# Altium schematic sheet 12_USB3.1 Type-A x2 (A).SchDoc: C200
size 439 x 311 mm; Page Create Date: March  8, 1995; Page Number: 12; Page Size: Custom; Comment: radxa_1010; Page Count: 21; RevCode: V1.11; Doc: 12_USB3.1 Type-A x2 (A); DsnPath: D:\WMS\C200\CC122\对外\C200 V1.11.DSN; SchematicName: c200; PageName: 12_USB3.1 Type-A x2 (A); PageSize: Custom; TopSchematic: True
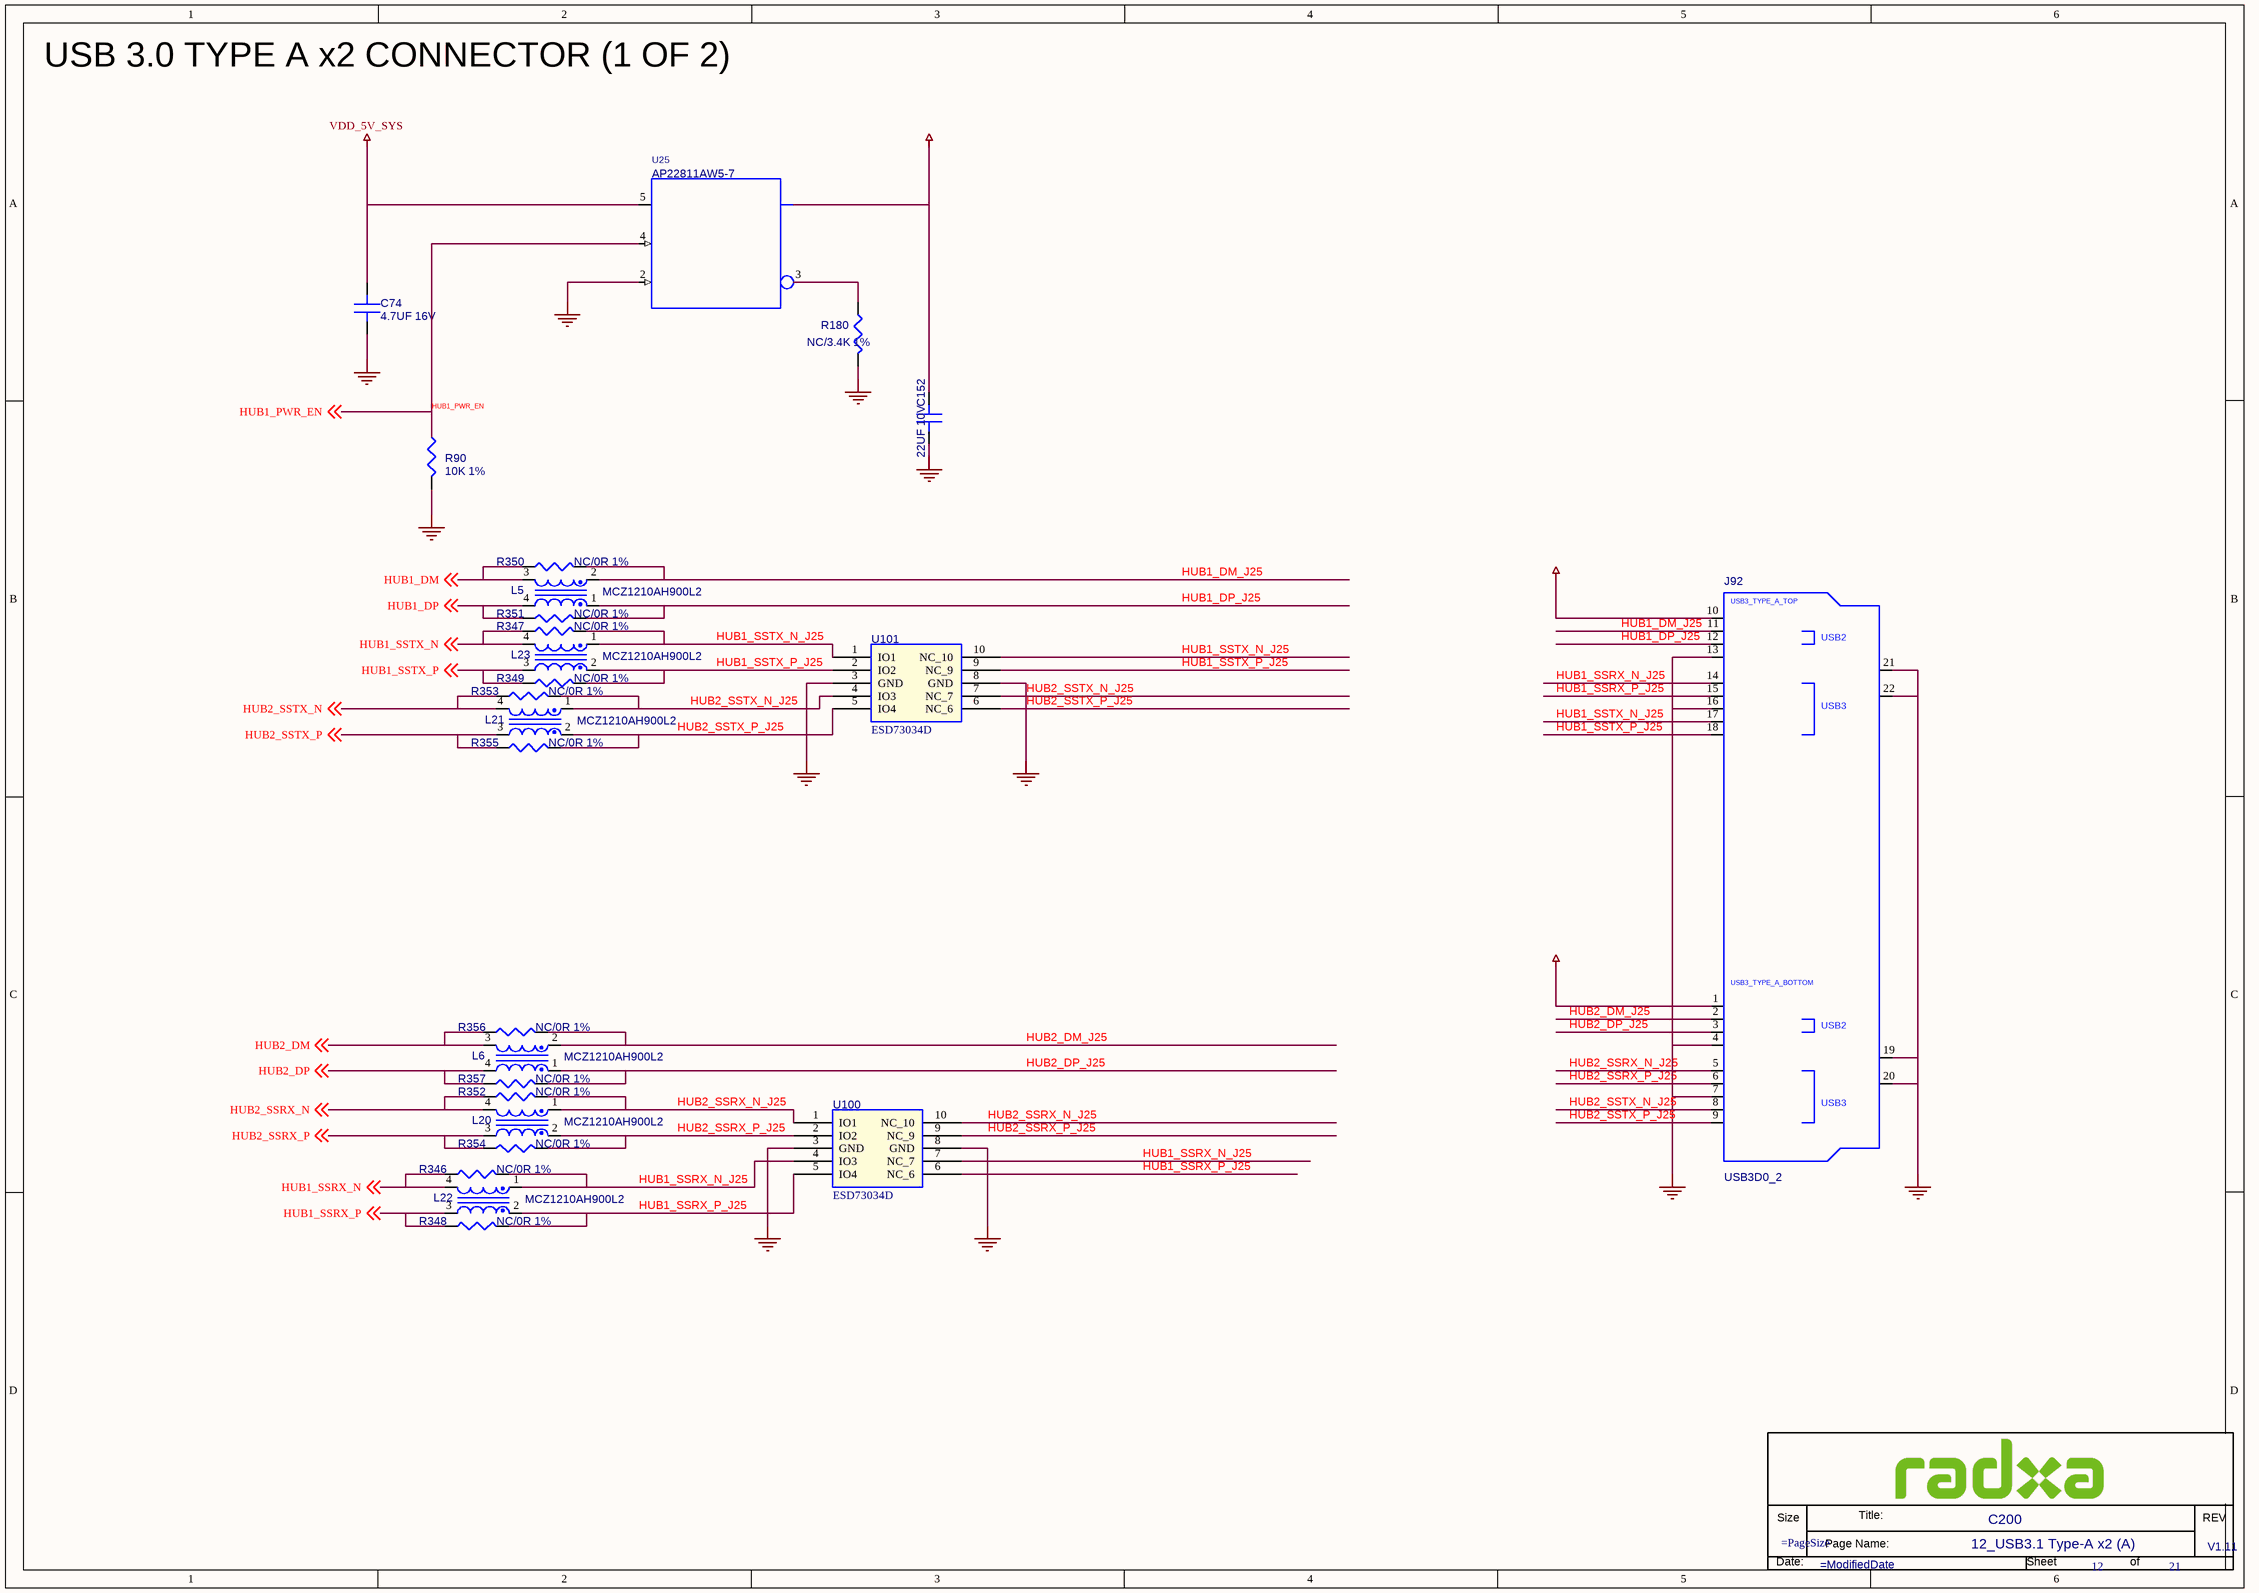
[diagram p0: 12_USB3.1 Type-A x2 (A).SchDoc]

## Parts
*  Doc: 12_USB3.1 Type-A x2 (A)  RevCode: V1.11  Title: C200  Page Number: 12  Page Count: 21  (hidden comment: radxa_1010)  (graphical)
C74  4.7UF 16V  [C0603]
C152  22UF 10V  [C0603]
J92  USB3D0_2  [USB3_TH18_17D0X14D0_LIE]
L5  MCZ1210AH900L2  [LC1210]
L6  MCZ1210AH900L2  [LC1210]
L20  MCZ1210AH900L2  [LC1210]
L21  MCZ1210AH900L2  [LC1210]
L22  MCZ1210AH900L2  [LC1210]
L23  MCZ1210AH900L2  [LC1210]
R90  10K 1%  [R0402]
R180  NC/3.4K 1%  [R0402]
R346  NC/0R 1%  [R0402]
R347  NC/0R 1%  [R0402]
R348  NC/0R 1%  [R0402]
R349  NC/0R 1%  [R0402]
R350  NC/0R 1%  [R0402]
R351  NC/0R 1%  [R0402]
R352  NC/0R 1%  [R0402]
R353  NC/0R 1%  [R0402]
R354  NC/0R 1%  [R0402]
R355  NC/0R 1%  [R0402]
R356  NC/0R 1%  [R0402]
R357  NC/0R 1%  [R0402]
U25  AP22811AW5-7  [SOT23_5]
U100  ESD73034D  [XSON10_0D5_1D1X2D6]
U101  ESD73034D  [XSON10_0D5_1D1X2D6]

## Nets
HUB2_SSTX_N_J25: C74.2(B) C152.2(B) J92.4(GND1) J92.7(GND2) J92.8(SSTXN0) J92.9(SSTXP0) J92.13(GND3) J92.16(GND4) J92.19(MT1) J92.20(MT2) J92.21(MT3) J92.22(MT4) L21.1 L21.2 R90.2 R180.1 R353.2 R355.2 U25.2(GND) U100.3(GND) U100.8(GND) U101.3(GND) U101.4(IO3) U101.5(IO4) U101.6(NC_6) U101.7(NC_7) U101.8(GND)  [also labelled GND, HUB2_SSTX_P_J25]
OUT: U25.1(OUT)
VDD_5V_SYS: C74.1(A) U25.5(IN)
VDD_USB_VBUSTYPEA: C152.1(A) J92.1(VBUS0) J92.10(VBUS1)
HUB1_DM: L5.3 R350.1 ; off-sheet HUB1_DM
HUB1_DM_J25: J92.11(DN1) L5.2 R350.2
HUB1_DP: L5.4 R351.1 ; off-sheet HUB1_DP
HUB1_DP_J25: J92.12(DP1) L5.1 R351.2
HUB1_PWR_EN: R90.1 U25.4(EN) ; off-sheet HUB1_PWR_EN
HUB1_SSRX_N: L22.4 R346.1 ; off-sheet HUB1_SSRX_N
HUB1_SSRX_N_J25: J92.14(SSRXN1) L22.1 R346.2 U100.4(IO3) U100.7(NC_7)
HUB1_SSRX_P: L22.3 R348.1 ; off-sheet HUB1_SSRX_P
HUB1_SSRX_P_J25: J92.15(SSRXP1) L22.2 R348.2 U100.5(IO4) U100.6(NC_6)
HUB1_SSTX_N: L23.4 R347.1 ; off-sheet HUB1_SSTX_N
HUB1_SSTX_N_J25: J92.17(SSTXN1) L23.1 R347.2 U101.1(IO1) U101.10(NC_10)
HUB1_SSTX_P: L23.3 R349.1 ; off-sheet HUB1_SSTX_P
HUB1_SSTX_P_J25: J92.18(SSTXP1) L23.2 R349.2 U101.2(IO2) U101.9(NC_9)
HUB2_DM: L6.3 R356.1 ; off-sheet HUB2_DM
HUB2_DM_J25: J92.2(DN0) L6.2 R356.2
HUB2_DP: L6.4 R357.1 ; off-sheet HUB2_DP
HUB2_DP_J25: J92.3(DP0) L6.1 R357.2
HUB2_SSRX_N: L20.4 R352.1 ; off-sheet HUB2_SSRX_N
HUB2_SSRX_N_J25: J92.5(SSRXN0) L20.1 R352.2 U100.1(IO1) U100.10(NC_10)
HUB2_SSRX_P: L20.3 R354.1 ; off-sheet HUB2_SSRX_P
HUB2_SSRX_P_J25: J92.6(SSRXP0) L20.2 R354.2 U100.2(IO2) U100.9(NC_9)
HUB2_SSTX_N: L21.4 R353.1 ; off-sheet HUB2_SSTX_N
HUB2_SSTX_P: L21.3 R355.1 ; off-sheet HUB2_SSTX_P
NetR180_2: R180.2 U25.3(OC*)

## Notes on the sheet
- USB 3.0 TYPE A x2 CONNECTOR (1 OF 2)
- (in symbol radxa_1010) Size; Title:; REV; Page Name:; Date:; Sheet; of
- (in symbol USB3D0_2) USB3_TYPE_A_TOP; USB2; USB3; USB3_TYPE_A_BOTTOM

## Library data of the parts
C74 = C: SMD  0603  4.7UF  16V  X5R  ±10%  ROHS; PARTS: 1; Part Reference: C74; Part Number: A1C01.00239; OriginalSymbolOrigin: (0,30); PKG_TYPE: CAP2-100-250; LEVEL: STD; PINSWAP: (A,B); Value: 4.7UF 16V; Part Type: 陶瓷电容; PCB Footprint: C0603
C152 = C: SMD  0603  22UF  10V  X5R  ±10%  ROHS; PARTS: 1; Part Reference: C152; Part Number: A1C01.00296; OriginalSymbolOrigin: (0,30); PKG_TYPE: CAP2-100-250; LEVEL: STD; PINSWAP: (A,B); Value: 22UF 10V; Part Type: 陶瓷电容; PCB Footprint: C0603
J92 = USB3D0_2: DIP  USB3.0母座  双层  卷边无定位柱  蓝色胶芯  17.5*14.5*H15.5mm  90度弯脚  弯脚固定间距15.6mm  不锈钢  WLUS-096H  兆联  ROHS; Part Reference: J92; Part Number: A1J08.00040; OriginalSymbolOrigin: (-300,1100); SKU: COMMON; SHROUDED: ?; SHIELDED: ?; REFLOW: ?; PLACEMENT_NOTE: ?; PITCH: ?; PATH: ?; PACK_TYPE: ?; NV_PN: ?; NV_NAME: ?; MAX_VOLTAGE: ?; MAX_CURRENT: ?; LATCHING: ?; GENDER: ?; EMI_GROUND_TAB: ?; ASSEMBLY: ?; ANGLE: ?; Value: USB3D0_2; Part Type: USB座; PCB Footprint: USB3_TH18_17D0X14D0_LIE
L5 = MCZ1210AH900L2: SMD  MCZ1210AH900L2TA0G  90R  4PIN  TDK  ROHS; Part Reference: L5; Part Number: A1L03.00007; PCB Footprint: LC1210; Value: MCZ1210AH900L2; Part Type: 共模电感
L6 = MCZ1210AH900L2: SMD  MCZ1210AH900L2TA0G  90R  4PIN  TDK  ROHS; Part Reference: L6; Part Number: A1L03.00007; PCB Footprint: LC1210; Value: MCZ1210AH900L2; Part Type: 共模电感
L20 = MCZ1210AH900L2: SMD  MCZ1210AH900L2TA0G  90R  4PIN  TDK  ROHS; Part Reference: L20; Part Number: A1L03.00007; PCB Footprint: LC1210; Value: MCZ1210AH900L2; Part Type: 共模电感
L21 = MCZ1210AH900L2: SMD  MCZ1210AH900L2TA0G  90R  4PIN  TDK  ROHS; Part Reference: L21; Part Number: A1L03.00007; PCB Footprint: LC1210; Value: MCZ1210AH900L2; Part Type: 共模电感
L22 = MCZ1210AH900L2: SMD  MCZ1210AH900L2TA0G  90R  4PIN  TDK  ROHS; Part Reference: L22; Part Number: A1L03.00007; PCB Footprint: LC1210; Value: MCZ1210AH900L2; Part Type: 共模电感
L23 = MCZ1210AH900L2: SMD  MCZ1210AH900L2TA0G  90R  4PIN  TDK  ROHS; Part Reference: L23; Part Number: A1L03.00007; PCB Footprint: LC1210; Value: MCZ1210AH900L2; Part Type: 共模电感
R90 = R: SMD  0402  10K  1/16W  ±1%  ROHS; Part Reference: R90; CDS_PHYS_PART_NAME: R_0402-10K,5 %,62.5MW,195-0486-000-10K,195-0486-000; CDS_PART_NAME: R_0402-10K,5 %,62.5MW,195-0486-000; Part Number: A1R01.00222; SEC: 1; XY: (-7750,6150); VER: 2; TOL: 5%; SIGNAL_MODEL: nv_res; ROT: 0; PHYS_PAGE: 14; PATH: I42; PACK_TYPE: 402; NV_PN: 195-0486-000; MAX_WATTAGE: 62.5mW; DRAWING: #NAME?; DEVICE_TYPENAME: R_0402-10K5625MW195-0486-000-10K195-0486-000; CDS_LIB: discrete; ASSEMBLY: USB3_TYPEA; PCB Footprint: R0402; Value: 10K 1%; CHIPS_PART_NAME: R; CDS_SEC: 1; Part Type: 贴片电阻
R180 = R: SMD  0402  3.4K  1/16W  ±1%  ROHS; Part Reference: R180; Part Number: A1R01.00506; PCB Footprint: R0402; Value: NC/3.4K 1%; Part Type: 贴片电阻
R346 = R: SMD  0402  0R  1/16W  ±1%  ROHS; Part Reference: R346; Part Number: A1R01.00219; PCB Footprint: R0402; Value: NC/0R 1%; Part Type: 贴片电阻
R347 = R: SMD  0402  0R  1/16W  ±1%  ROHS; Part Reference: R347; Part Number: A1R01.00219; PCB Footprint: R0402; Value: NC/0R 1%; Part Type: 贴片电阻
R348 = R: SMD  0402  0R  1/16W  ±1%  ROHS; Part Reference: R348; Part Number: A1R01.00219; PCB Footprint: R0402; Value: NC/0R 1%; Part Type: 贴片电阻
R349 = R: SMD  0402  0R  1/16W  ±1%  ROHS; Part Reference: R349; Part Number: A1R01.00219; PCB Footprint: R0402; Value: NC/0R 1%; Part Type: 贴片电阻
R350 = R: SMD  0402  0R  1/16W  ±1%  ROHS; Part Reference: R350; Part Number: A1R01.00219; PCB Footprint: R0402; Value: NC/0R 1%; Part Type: 贴片电阻
R351 = R: SMD  0402  0R  1/16W  ±1%  ROHS; Part Reference: R351; Part Number: A1R01.00219; PCB Footprint: R0402; Value: NC/0R 1%; Part Type: 贴片电阻
R352 = R: SMD  0402  0R  1/16W  ±1%  ROHS; Part Reference: R352; Part Number: A1R01.00219; PCB Footprint: R0402; Value: NC/0R 1%; Part Type: 贴片电阻
R353 = R: SMD  0402  0R  1/16W  ±1%  ROHS; Part Reference: R353; Part Number: A1R01.00219; PCB Footprint: R0402; Value: NC/0R 1%; Part Type: 贴片电阻
R354 = R: SMD  0402  0R  1/16W  ±1%  ROHS; Part Reference: R354; Part Number: A1R01.00219; PCB Footprint: R0402; Value: NC/0R 1%; Part Type: 贴片电阻
R355 = R: SMD  0402  0R  1/16W  ±1%  ROHS; Part Reference: R355; Part Number: A1R01.00219; PCB Footprint: R0402; Value: NC/0R 1%; Part Type: 贴片电阻
R356 = R: SMD  0402  0R  1/16W  ±1%  ROHS; Part Reference: R356; Part Number: A1R01.00219; PCB Footprint: R0402; Value: NC/0R 1%; Part Type: 贴片电阻
R357 = R: SMD  0402  0R  1/16W  ±1%  ROHS; Part Reference: R357; Part Number: A1R01.00219; PCB Footprint: R0402; Value: NC/0R 1%; Part Type: 贴片电阻
U25 = AP22811AW5-7: SMD  功率电子开关  AP22811AW5-7  2A;2.7V~5.5V,Active High  SOT23_5  DIODES(美台)  ROHS; Part Reference: U25; Part Number: A1I01.00763; OriginalSymbolOrigin: (-250,250); Temp Coeff: -40℃~85℃; ASSEMBLY: ?; MAX_CURRENT: ?; MAX_VOLTAGE: ?; NV_NAME: ?; NV_PN: ?; OUTPUT_VOLTAGE: ?; PACK_TYPE: ?; PATH: ?; PLACEMENT_NOTE: ?; SKU: COMMON; TYPE: ?; Value: AP22811AW5-7; Part Type: 集成电路/模块; PCB Footprint: SOT23_5
U100 = ESD73034D: SMD  编带  SON10  ESD73034D-10/TR  4Line 双向TVS  VRWM=3.3V  0.2pF  33W  WILLSEMI(韦尔)  ROHS; Part Reference: U100; Part Number: A1D02.00015; Parameter: ESD-ESD73034D-封装 SON10_2R50X1R00X0R50; PCB Footprint: XSON10_0D5_1D1X2D6; Value: ESD73034D; Part Type: 二极管-ESD管-桥堆-TVS管
U101 = ESD73034D: SMD  编带  SON10  ESD73034D-10/TR  4Line 双向TVS  VRWM=3.3V  0.2pF  33W  WILLSEMI(韦尔)  ROHS; Part Reference: U101; Part Number: A1D02.00015; Parameter: ESD-ESD73034D-封装 SON10_2R50X1R00X0R50; PCB Footprint: XSON10_0D5_1D1X2D6; Value: ESD73034D; Part Type: 二极管-ESD管-桥堆-TVS管
* = radxa_1010: Page Create Date: March  8, 1995; Page Size: =PageSize; Page Modify Date: =ModifiedDate